# Altium schematic sheet Sheet_1_2023-05-31.schdoc
size 482 x 163 mm
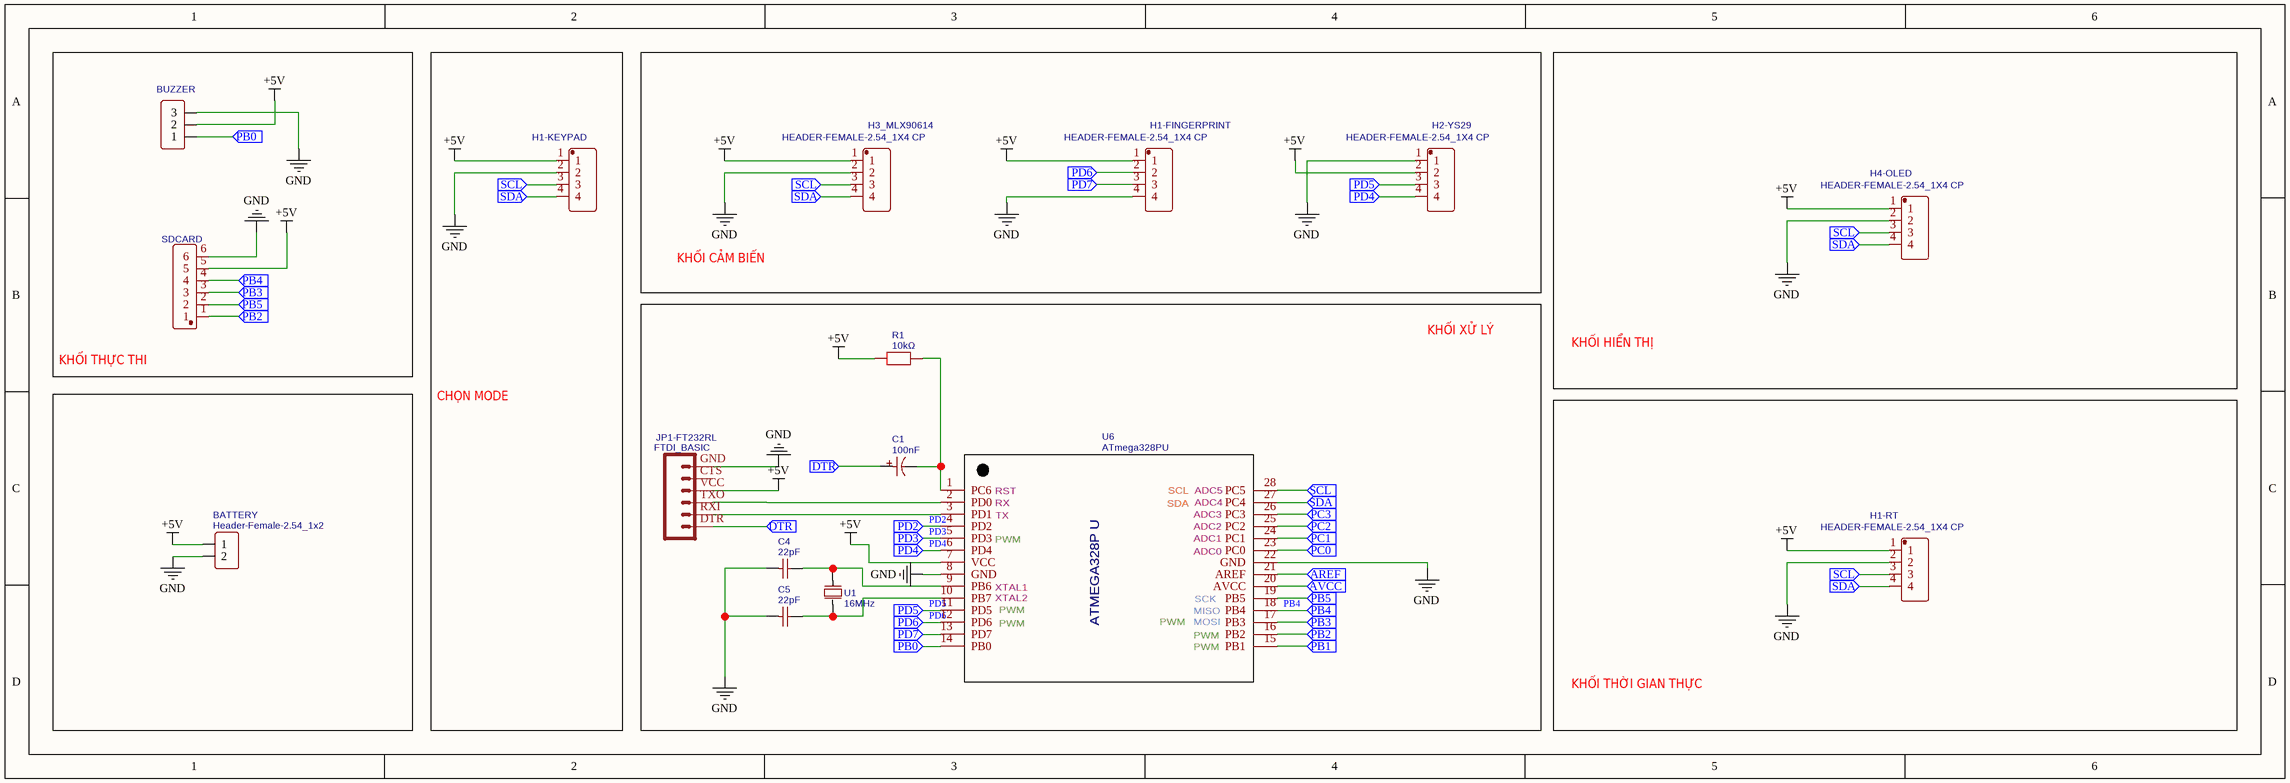
[diagram p0: Sheet_1_2023-05-31.schdoc]

## Parts
BATTERY  Header-Female-2.54_1x2  [HDR-TH_2P-P2.54-V-F]
BUZZER  Header-Female-2.54_1x3  [HDR-TH_3P-P2.54-V-F]  (value not drawn)
C1  100nF  [CAP-TH_BD5.0-P2.00-D0.8-FD]
C4  22pF  [CAP-TH_L8.5-W5.0-P5.00-D1.2]
C5  22pF  [CAP-TH_L8.5-W5.0-P5.00-D1.2]
H1-FINGERPRINT  HEADER-FEMALE-2.54_1X4 CP  [HEADER - HEADER-FEMALE-2.54_1X4]
H1-KEYPAD  HEADER-FEMALE-2.54_1X4 CP  [HEADER - HEADER-FEMALE-2.54_1X4]  (value not drawn)
H1-RT  HEADER-FEMALE-2.54_1X4 CP  [HEADER - HEADER-FEMALE-2.54_1X4]
H2-YS29  HEADER-FEMALE-2.54_1X4 CP  [HEADER - HEADER-FEMALE-2.54_1X4]
H3_MLX90614  HEADER-FEMALE-2.54_1X4 CP  [HEADER - HEADER-FEMALE-2.54_1X4]
H4-OLED  HEADER-FEMALE-2.54_1X4 CP  [HEADER - HEADER-FEMALE-2.54_1X4]
JP1-FT232RL  FTDI_BASIC  [FTDI_BASIC]
R1  10kΩ  [RES-TH_BD4.5-L11.5-P15.50-D0.7]
SDCARD  Header-Female-2.54_1x6  [HDR-TH_6P-P2.54-V-F]  (value not drawn)
U1  16MHz  [CRYSTAL-TH_L10.8-W4.5-P4.88]
U6  ATmega328PU  [DIP-28 ATMEGA328P U]

## Blocks framed on the sheet
KHỐI THỰC THI: BUZZER SDCARD
CHỌN MODE: H1-KEYPAD
KHỐI CẢM BIẾN: H1-FINGERPRINT H2-YS29 H3_MLX90614
KHỐI HIỂN THỊ: H4-OLED
KHỐI XỬ LÝ: C1 C4 C5 JP1-FT232RL R1 U1 U6
KHỐI THỜI GIAN THỰC: H1-RT

## Ports
AREF (in), AVCC (in), DTR (in), PB0 (in), PB1 (in), PB2 (in), PB3 (in), PB4 (in), PB5 (in), PC0 (in), PC1 (in), PC2 (in), PC3 (in), PD2 (in), PD3 (in), PD4 (in), PD5 (in), PD6 (in), PD7 (in), SCL (in), SDA (in)

## Nets
+5V: BATTERY.1 BUZZER.2 H1-FINGERPRINT.1 H1-KEYPAD.1 H1-RT.1 H2-YS29.2 H3_MLX90614.1 H4-OLED.1 JP1-FT232RL.VCC R1.1 SDCARD.5 U6.7(VCC)
GND: BATTERY.2 BUZZER.3 C4.1 C5.1 H1-FINGERPRINT.4 H1-KEYPAD.2 H1-RT.2 H2-YS29.1 H3_MLX90614.2 H4-OLED.2 JP1-FT232RL.GND SDCARD.6 U6.8(GND) U6.22(GND)
AREF: U6.21(AREF) ; port AREF
AVCC: U6.20(AVCC) ; port AVCC
DTR: C1.1 JP1-FT232RL.DTR ; port DTR
PB0: BUZZER.1 U6.14(PB0) ; port PB0
PB1: U6.15(PB1) ; port PB1
PB2: SDCARD.1 U6.16(PB2) ; port PB2
PB3: SDCARD.3 U6.17(PB3) ; port PB3
PB4: SDCARD.4 U6.18(PB4) ; port PB4
PB5: SDCARD.2 U6.19(PB5) ; port PB5
PC0: U6.23(PC0) ; port PC0
PC1: U6.24(PC1) ; port PC1
PC2: U6.25(PC2) ; port PC2
PC3: U6.26(PC3) ; port PC3
PD2: U6.4(PD2) ; port PD2
PD3: U6.5(PD3) ; port PD3
PD4: H2-YS29.4 U6.6(PD4) ; port PD4
PD5: H2-YS29.3 U6.11(PD5) ; port PD5
PD6: H1-FINGERPRINT.2 U6.12(PD6) ; port PD6
PD7: H1-FINGERPRINT.3 U6.13(PD7) ; port PD7
SCL: H1-KEYPAD.3 H1-RT.3 H3_MLX90614.3 H4-OLED.3 U6.28(PC5) ; port SCL
SDA: H1-KEYPAD.4 H1-RT.4 H3_MLX90614.4 H4-OLED.4 U6.27(PC4) ; port SDA
NetC1_2: C1.2 R1.2 U6.1(PC6)
NetC4_2: C4.2 U1.2 U6.9(PB6)
NetC5_2: C5.2 U1.1 U6.10(PB7)
NetJP1-FT232RL_RXI: JP1-FT232RL.RXI U6.3(PD1)
NetJP1-FT232RL_TXO: JP1-FT232RL.TXO U6.2(PD0)

Not connected (* = marked no-connect by the designer): JP1-FT232RL CTS(5)

## Notes on the sheet
- (in symbol ATmega328PU) RST; SCL; ADC5; RX; SDA; ADC4; TX; ADC3; ADC2; PWM; ADC1; ADC0; XTAL1; XTAL2; SCK; MISO; ATMEGA328P U; MOSI

## Library data of the parts
BATTERY = Header-Female-2.54_1x2: BOM_Manufacturer: BOOMELE(博穆精密); BOM_Manufacturer Part: 2.54-1*2P母; BOM_Supplier: LCSC; BOM_Supplier Part: C49661; BOM_JLCPCB Part Class: Extended Part; spicePre: P; spiceSymbolName: Header-Female-2.54_1x2
BUZZER = Header-Female-2.54_1x3: BOM_Manufacturer: BOOMELE(博穆精密); BOM_Manufacturer Part: 2.54-1*3P母; BOM_Supplier Part: C146243; BOM_Supplier: LCSC; link: https://datasheet.lcsc.com/szlcsc/Boom-Precision-Elec-2-54mm-1-8P-Straight-Female-header_C27438.pdf; BOM_JLCPCB Part Class: Extended Part; spicePre: P; spiceSymbolName: Header-Female-2.54_1x3
C1 = 100nF: BOM_Manufacturer: ValuePro; BOM_Manufacturer Part: 0.1uF 50V 5*11; nameAlias: Capacitance; BOM_Supplier: LCSC; BOM_Supplier Part: C45091; BOM_JLCPCB Part Class: Extended Part; spicePre: C; spiceSymbolName: 0.1uF 50V 5*11
C4 C5 = 22pF: BOM_Manufacturer: ReliaPro; BOM_Manufacturer Part: CC4-0805N220 J500; nameAlias: Capacitance; BOM_Supplier: LCSC; BOM_Supplier Part: C3781; spicePre: C; spiceSymbolName: CC4-0805N220 J500
H1-FINGERPRINT H1-KEYPAD H1-RT H2-YS29 H3_MLX90614 H4-OLED = HEADER-FEMALE-2.54_1X4 CP: Contributor: chrisrisse; BOM_Supplier: Sparkfun; spicePre: H; spiceSymbolName: HEADER - HEADER-FEMALE-2.54_1X4 CP
JP1-FT232RL = FTDI_BASIC: Contributor: SparkFun; BOM_Manufacturer Part: ?; spicePre: J
R1 = 10kΩ: BOM_Manufacturer: 华星机电; BOM_Manufacturer Part: MF2WS-10KΩ±1%T; nameAlias: Resistance; Contributor: LCSC; BOM_Supplier: LCSC; BOM_Supplier Part: C714145; Resistance (Ohms): 10kΩ; BOM_JLCPCB Part Class: Extended Part; spicePre: R; spiceSymbolName: MF2WS-10KΩ±1%T
SDCARD = Header-Female-2.54_1x6: BOM_Manufacturer: BOOMELE(博穆精密); BOM_Manufacturer Part: 2.54-1*6P母; BOM_Supplier: LCSC; BOM_Supplier Part: C40877; BOM_JLCPCB Part Class: Extended Part; spicePre: P; spiceSymbolName: Header-Female-2.54_1x6
U1 = 16MHz: BOM_Manufacturer: CTS(西迪斯); BOM_Manufacturer Part: MP160B; Contributor: lcsc; nameAlias: Frequency; BOM_Supplier: LCSC; BOM_Supplier Part: C1669778; link: https://atta.szlcsc.com/upload/public/pdf/source/20210630/3CF27633FECB5E774344157C479F0658.pdf; spicePre: U; spiceSymbolName: MP160B
U6 = ATmega328PU: BOM_Manufacturer: ATMEL; BOM_Manufacturer Part: 328PU; BOM_EasyEDA: E46335; Contributor: jakub.mat977; BOM_Supplier Part: E46335; BOM_Supplier: EasyEDA; 328PU: 328PU; spicePre: U; spiceSymbolName: ATmega328PU